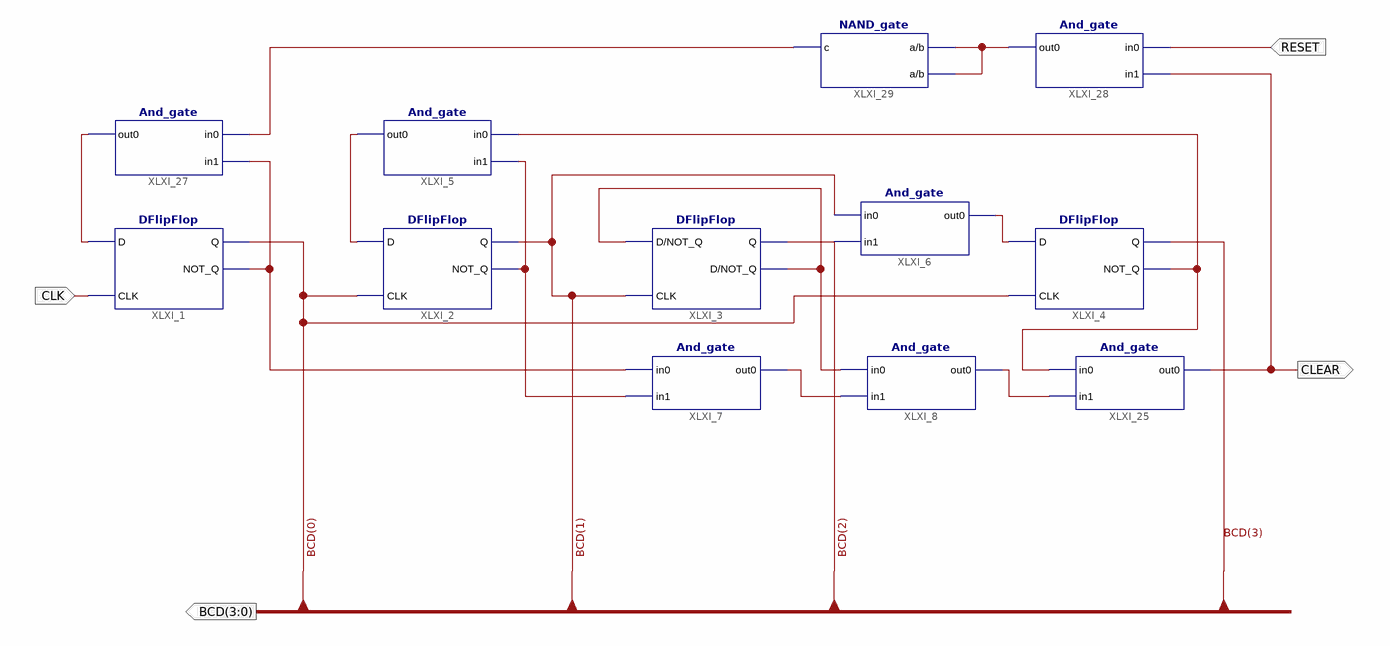
[diagram p0: schematic sheet 1]
// Xilinx ISE schematic BCD_4.sch (spartan6) as structural Verilog: 12 symbols, 4 ports
module BCD_4 (
  input  CLK,
  input  RESET,
  output CLEAR,
  output [3:0] BCD
);

  wire XLXN_3, XLXN_5, XLXN_10, XLXN_11, XLXN_41, XLXN_54, XLXN_55, XLXN_56, XLXN_61, XLXN_77, XLXN_79;

  DFlipFlop XLXI_1 (.D(XLXN_56), .Q(BCD[0]), .NOT_Q(XLXN_54), .CLK(CLK));
  DFlipFlop XLXI_2 (.D(XLXN_5), .Q(BCD[1]), .NOT_Q(XLXN_3), .CLK(BCD[0]));
  DFlipFlop XLXI_3 (.D(XLXN_79), .Q(BCD[2]), .NOT_Q(XLXN_79), .CLK(BCD[1]));
  And_gate XLXI_5 (.in0(XLXN_11), .in1(XLXN_3), .out0(XLXN_5));
  And_gate XLXI_6 (.in0(BCD[1]), .in1(BCD[2]), .out0(XLXN_10));
  DFlipFlop XLXI_4 (.D(XLXN_10), .Q(BCD[3]), .NOT_Q(XLXN_11), .CLK(BCD[0]));
  And_gate XLXI_7 (.in0(XLXN_54), .in1(XLXN_3), .out0(XLXN_77));
  And_gate XLXI_8 (.in0(XLXN_79), .in1(XLXN_77), .out0(XLXN_41));
  And_gate XLXI_25 (.in0(XLXN_11), .in1(XLXN_41), .out0(CLEAR));
  And_gate XLXI_27 (.in0(XLXN_55), .in1(XLXN_54), .out0(XLXN_56));
  And_gate XLXI_28 (.in0(RESET), .in1(CLEAR), .out0(XLXN_61));
  NAND_gate XLXI_29 (.a(XLXN_61), .b(XLXN_61), .c(XLXN_55));
endmodule
